# Altium project PCB_Project.PrjPcb
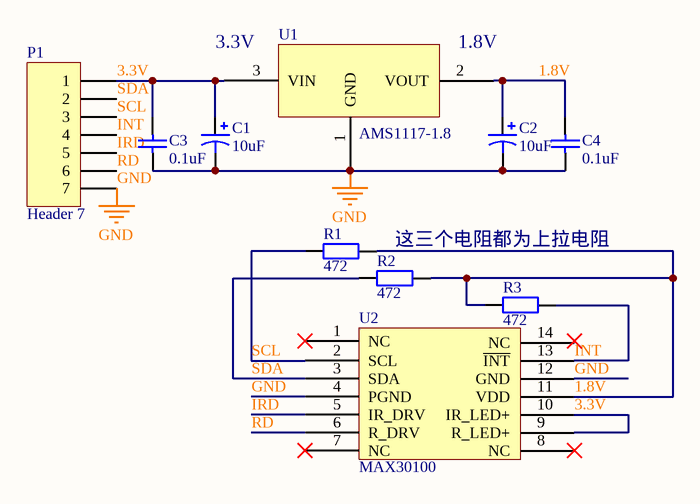
[diagram p0: Sheet1.SchDoc]
1 sheet, 10 parts. Net scope: global (net labels, ports and power ports of the same name join across sheets).
Board file: PCB1.PcbDoc

## Sheet Sheet1.SchDoc
size A4

### Parts
C1  value 10uF  [1210]  (hidden comment: Cap Pol1)
C2  value 10uF  [1210]  (hidden comment: Cap Pol1)
C3  value 0.1uF  [0603]  (hidden comment: Cap)
C4  value 0.1uF  [0603]  (hidden comment: Cap)
P1  Header 7  [HDR1X7]
R1  value 472  [0603]  (hidden comment: Res2)
R2  value 472  [0603]  (hidden comment: Res2)
R3  value 472  [0603]  (hidden comment: Res2)
U1  AMS1117-1.8  [SOT-223]
U2  MAX30100  [MAX30100]

### Nets
GND: C1.2 C2.2 C3.2 C4.1 P1.7 U1.1(GND) U2.4(PGND) U2.12(GND)
1.8V: C2.1 C4.2 R1.2 R2.2 R3.1 U1.2(VOUT) U2.11(VDD)
3.3V: C1.1 C3.1 P1.1 U1.3(VIN) U2.9(R_LED+) U2.10(IR_LED+)
INT: P1.4 R3.2 U2.13(~{INT})
IRD: P1.5 U2.5(IR_DRV)
RD: P1.6 U2.6(R_DRV)
SCL: P1.3 R1.1 U2.2(SCL)
SDA: P1.2 R2.1 U2.3(SDA)

Not connected (* = marked no-connect by the designer): U2 1(NC)* 7(NC)* 8(NC)* 14(NC)

### Notes on the sheet
- (near U1) 3.3V
- (near U1) 1.8V
- 这三个电阻都为上拉电阻

### Library data of the parts
C1 C2 = Cap Pol1: Polarized Capacitor (Radial); Published: 8-Jun-2000; LatestRevisionDate: 17-Jul-2002; LatestRevisionNote: Re-released for DXP Platform.; PackageReference: RB7.6-15; Publisher: Altium Limited; PackageDescription: Polarized Capacitor (Radial); 2 Leads
C3 C4 = Cap: Capacitor; Published: 8-Jun-2000; LatestRevisionDate: 17-Jul-2002; LatestRevisionNote: Re-released for DXP Platform.; PackageReference: RAD-0.3; Publisher: Altium Limited; PackageDescription: Radial Cap, Thru-Hole; 2 Leads; 0.3 in Pin Spacing
P1 = Header 7: Header, 7-Pin; LatestRevisionDate: 17-Jul-2002; LatestRevisionNote: Re-released for DXP Platform.; Publisher: Altium Limited
R1-R3 = Res2: Resistor; Published: 8-Jun-2000; LatestRevisionDate: 17-Jul-2002; LatestRevisionNote: Re-released for DXP Platform.; PackageReference: AXIAL-0.4; Publisher: Altium Limited; PackageDescription: Axial Device, Thru-Hole; 2 Leads; 0.4 in Pin Spacing
U1 = AMS1117-1.8: 3.3V~12V->1.8V